# Altium schematic sheet ForceACQ.SchDoc: Force Acquisition Channel
size A4; Author: Joao Guimarae; Organization: Altium Limited; Address1: L3, 12a Rodborough Rd; Address2: Frenchs Forest; Address3: NSW; Address4: Australia 2086; Revision: 1.0.0
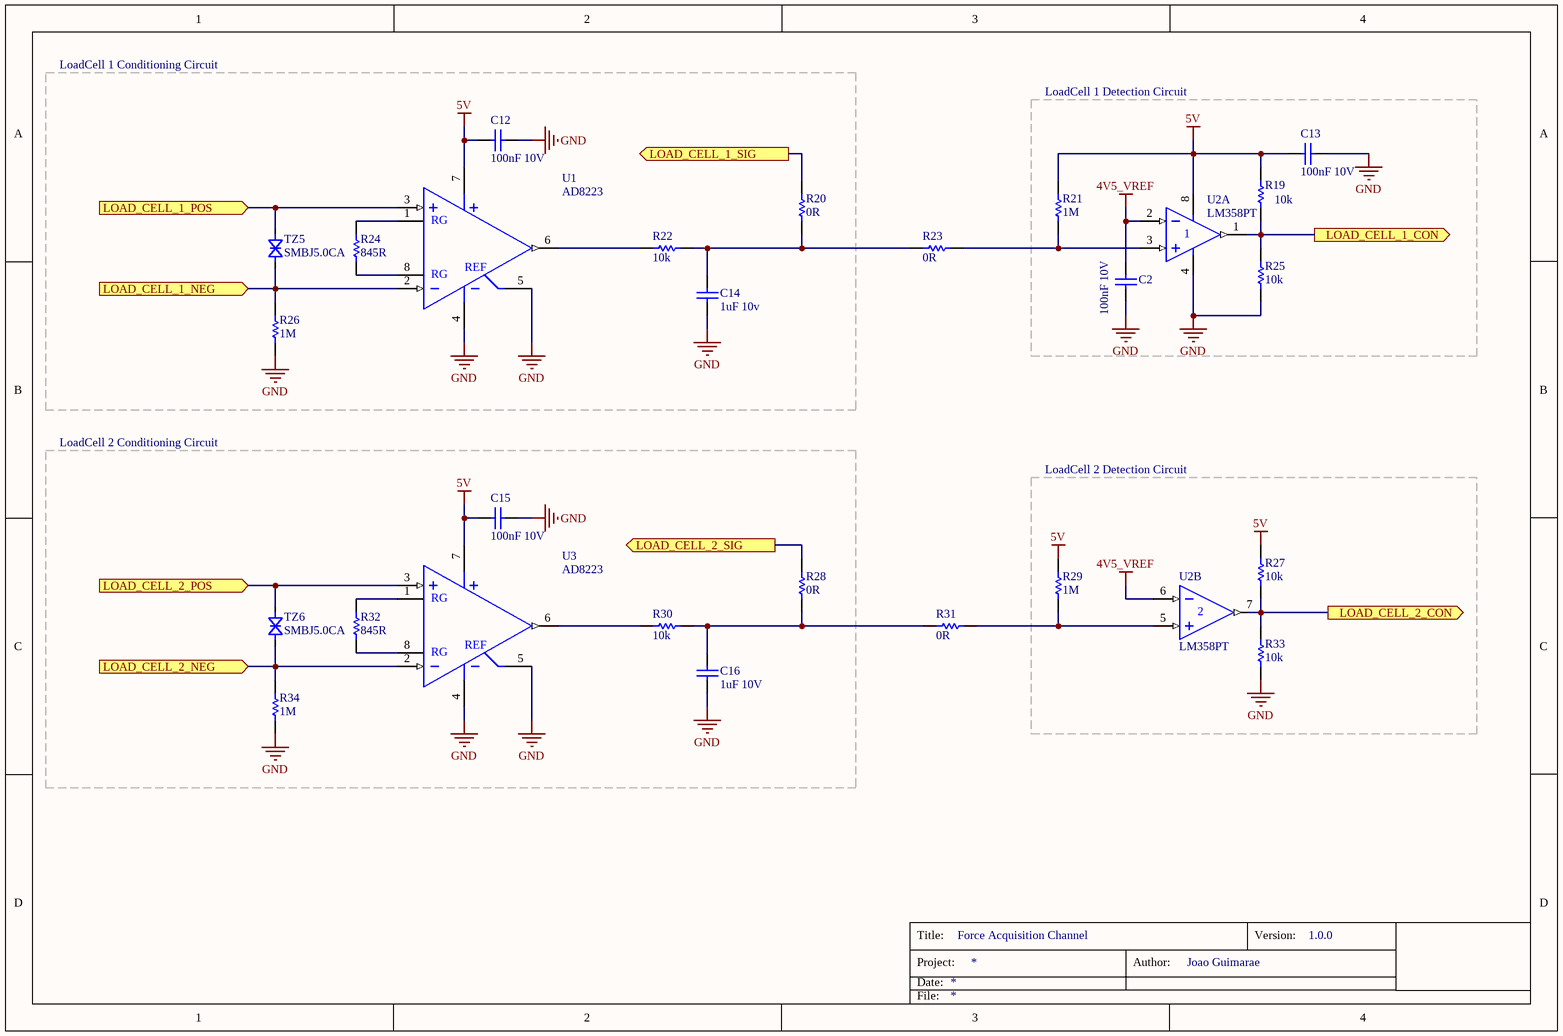
[diagram p0: ForceACQ.SchDoc]

## Parts
C2  100nF 10V  [0402]
C12  100nF 10V  [0402]
C13  100nF 10V  [0402]
C14  1uF 10v  [C0805]
C15  100nF 10V  [0402]
C16  1uF 10V  [C0805]
R19  10k  [6-0805_M]
R20  0R  [6-0805_M]
R21  1M  [6-0805_M]
R22  10k  [6-0805_M]
R23  0R  [6-0805_M]
R24  845R  [0402]
R25  10k  [6-0805_M]
R26  1M  [6-0805_M]
R27  10k  [6-0805_M]
R28  0R  [6-0805_M]
R29  1M  [6-0805_M]
R30  10k  [6-0805_M]
R31  0R  [6-0805_M]
R32  845R  [0402]
R33  10k  [6-0805_M]
R34  1M  [6-0805_M]
TZ5  SMBJ5.0CA  [DO-214AA]
TZ6  SMBJ5.0CA  [DO-214AA]
U1  AD8223  [SO8_M]
U2  LM358PT  [TSOP-8]  (parts A,B of 2)
U3  AD8223  [SO8_M]

## Blocks framed on the sheet
LoadCell 1 Conditioning Circuit: C12 C14 R20 R22 R24 R26 TZ5 U1
LoadCell 1 Detection Circuit: C2 C13 R19 R21 R25 U2
LoadCell 2 Conditioning Circuit: C15 C16 R28 R30 R32 R34 TZ6 U3
LoadCell 2 Detection Circuit: R27 R29 R33 U2

## Ports
LOAD_CELL_1_CON (out), LOAD_CELL_1_NEG (in), LOAD_CELL_1_POS (in), LOAD_CELL_1_SIG (out), LOAD_CELL_2_CON (out), LOAD_CELL_2_NEG (in), LOAD_CELL_2_POS (in), LOAD_CELL_2_SIG (out)

## Nets
4V5_VREF: C2.2 U2.2(IN-) U2.6(IN-)
5V: C12.1 C13.2 C15.1 R19.1 R21.1 R27.1 R29.1 U1.7(+Vs) U2.8(Vs+) U3.7(+Vs)
GND: C2.1 C12.2 C13.1 C14.1 C15.2 C16.1 R25.2 R26.2 R33.2 R34.2 U1.4(-Vs) U1.5(REF) U2.4(Vs-) U3.4(-Vs) U3.5(REF)
LOAD_CELL_1_CON: R19.2 R25.1 U2.1(OUT) ; port LOAD_CELL_1_CON
LOAD_CELL_1_NEG: R26.1 TZ5.1(C) U1.2(IN-) ; port LOAD_CELL_1_NEG
LOAD_CELL_1_POS: TZ5.2(A) U1.3(IN+) ; port LOAD_CELL_1_POS
LOAD_CELL_1_SIG: R20.2 ; port LOAD_CELL_1_SIG
LOAD_CELL_2_CON: R27.2 R33.1 U2.7(OUT) ; port LOAD_CELL_2_CON
LOAD_CELL_2_NEG: R34.1 TZ6.1(C) U3.2(IN-) ; port LOAD_CELL_2_NEG
LOAD_CELL_2_POS: TZ6.2(A) U3.3(IN+) ; port LOAD_CELL_2_POS
LOAD_CELL_2_SIG: R28.2 ; port LOAD_CELL_2_SIG
NetC14_2: C14.2 R20.1 R22.2 R23.2
NetC16_2: C16.2 R28.1 R30.2 R31.2
NetR21_2: R21.2 R23.1 U2.3(IN+)
NetR22_1: R22.1 U1.6(OUT)
NetR24_1: R24.1 U1.8(RG)
NetR24_2: R24.2 U1.1(RG)
NetR29_2: R29.2 R31.1 U2.5(IN+)
NetR30_1: R30.1 U3.6(OUT)
NetR32_1: R32.1 U3.8(RG)
NetR32_2: R32.2 U3.1(RG)

## Notes on the sheet
- Title:
- Project:
- Date:
- Author:
- Version:
- File:

## Library data of the parts
C2 C12 C13 C15 = Cap: Capacitor; PartNumber: CAP.100n.10V.20%.SMD.0402; Manufacturer: Wurth; Price: 0.015; Supplier: Mouser
  C2: ClassName: TemperatureACQ
  C12 C13 C15: ClassName: ForceACQ
C14 C16 = Cap: Capacitor; PartNumber: CAP.1u.10V.10%.SMD.0805; Manufacturer: Vishay; ClassName: ForceACQ; Price: 0.17; Supplier: Mouser
R19 R22 R25 R27 R30 R33 = Res: Resistor; PartNumber: RES.10K.1/8W.5%.SMD.0805; Manufacturer: Yageo; ClassName: ForceACQ; Price: 0.012; Supplier: Mouser
R20 R23 R28 R31 = Res: Resistor; PartNumber: RES.0R.1/8W.5%.SMD.0805; Manufacturer: Vishay; ClassName: ForceACQ; Price: 0.044; Supplier: Mouser
R21 R26 R29 R34 = Res: Resistor; PartNumber: RES.1M.1/8W.5%.SMD.0805; Manufacturer: Bourns; ClassName: ForceACQ; Supplier: Mouser
  R21 R29 R34: Price: 0.012
  R26: Price: 0.10
R24 R32 = Res: Resistor; PartNumber: RES.845R.1/8W.1%.SMD.0402; Manufacturer: Yageo; ClassName: ForceACQ; Price: 0.10; Supplier: Mouser
TZ5 TZ6 = SMBJ5.0CA: ESD Suppressors / TVS Diodes 5Vr 600W 65.3A 5% BiDirectional; pin to pad: 1>C 2>A; Manufacturer: Bourns; ClassName: ForceACQ; PartNumber: SMBJ5.0CA; Price: 0.44; Supplier: Mouser
U1 U3 = AD8223: Precision Instrumentation Amplifier; PartNumber: AD8223ARZ; Manufacturer: Analog Devices; ClassName: ForceACQ; Price: 2.89; Supplier: Mouser
U2 = LM358PT: Operational Amplifiers - Op Amps Dual Low Power; Manufacturer: STMicroelectronics; ClassName: ForceACQ; PartNumber: LM358PT; Price: 0.40; Supplier: Mouser